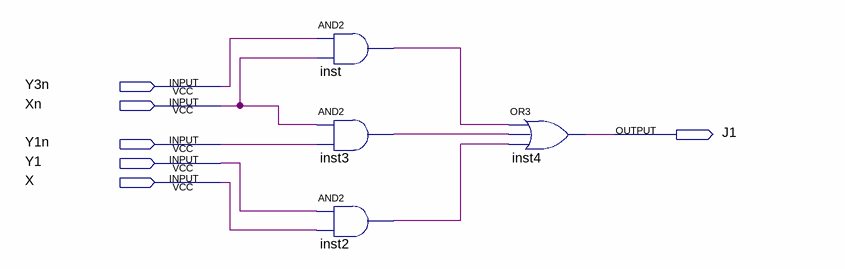
[diagram p0: schematic sheet]
// Quartus schematic J1.bdf as structural Verilog: 4 symbols, 6 pins
module J1 (
  input  Y3n,
  input  Xn,
  input  Y1n,
  input  Y1,
  input  X,
  output J1
);

  wire inst2_out, inst3_out, inst_out;

  and inst (inst_out, Y3n, Xn);
  and inst3 (inst3_out, Xn, Y1n);
  and inst2 (inst2_out, Y1, X);
  or inst4 (J1, inst_out, inst3_out, inst2_out);
endmodule
